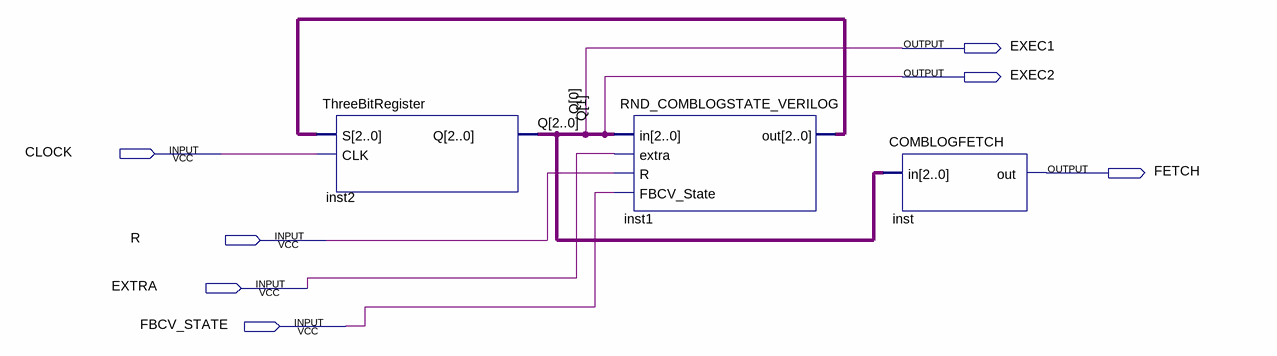
[diagram p0: schematic sheet]
// Quartus schematic RND_FBCV_Project_StateMachine_V1.bdf as structural Verilog: 3 symbols, 7 pins
module RND_FBCV_Project_StateMachine_V1 (
  input  CLOCK,
  input  R,
  input  EXTRA,
  input  FBCV_STATE,
  output EXEC1,
  output EXEC2,
  output FETCH
);

  wire [2:0] inst1_out;
  wire [2:2] Q;

  ThreeBitRegister inst2 (.S(inst1_out), .CLK(CLOCK), .Q({Q[2], EXEC2, EXEC1}));
  RND_COMBLOGSTATE_VERILOG inst1 (
    .in({Q[2], EXEC2, EXEC1}), .extra(EXTRA), .R(R), .FBCV_State(FBCV_STATE), .out(inst1_out));
  COMBLOGFETCH inst (.in({Q[2], EXEC2, EXEC1}), .out(FETCH));

  // Other names for the same wires on the sheet: Q[1:0] = {EXEC2, EXEC1}
endmodule
